# Altium schematic sheet Power.SchDoc
size A4
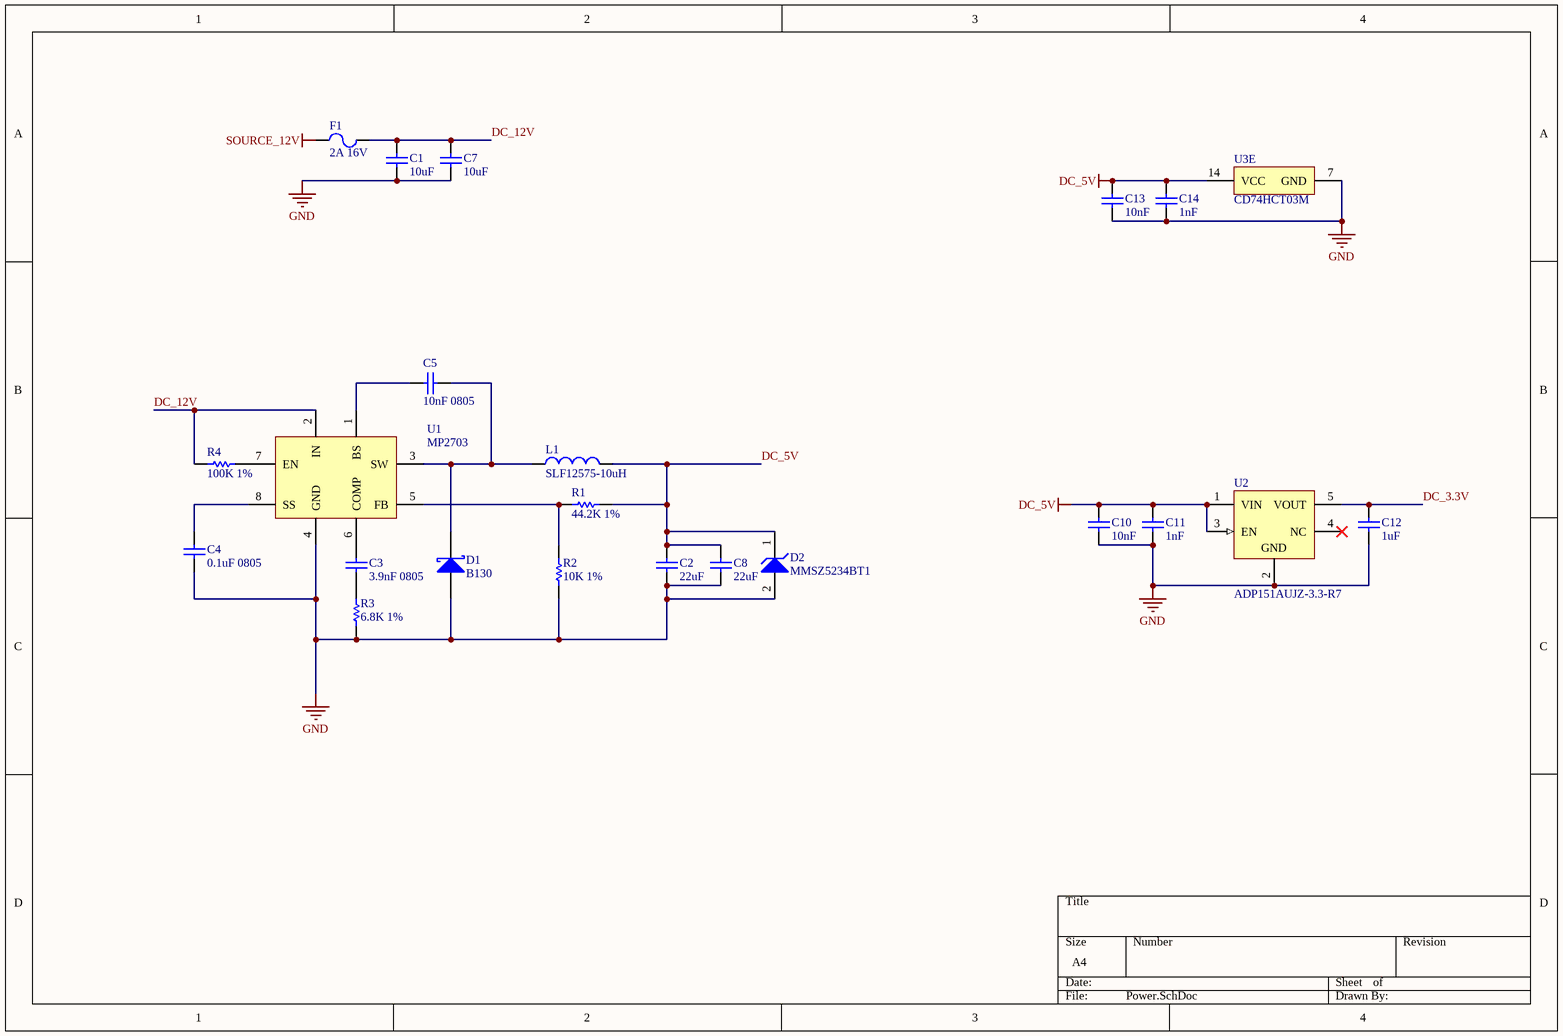
[diagram p0: Power.SchDoc]

## Parts
C1  10uF  [CAPC1206(3216)190_L]
C2  22uF  [CAPC1210(3225)250_M]
C3  3.9nF 0805  [CAPC0805(2012)145_N]
C4  0.1uF 0805  [CAPC0805(2012)145_N]
C5  10nF 0805  [CAPC0805(2012)145_N]
C7  10uF  [CAPC1206(3216)190_L]
C8  22uF  [CAPC1210(3225)250_M]
C10  10nF  [CAPC0805(2012)100_N]
C11  1nF  [CAPC0805(2012)100_N]
C12  1uF  [CAPC0805(2012)100_L]
C13  10nF  [CAPC0805(2012)100_N]
C14  1nF  [CAPC0805(2012)100_N]
D1  B130  [DIOD-SOD-123-2-A_V]
D2  MMSZ5234BT1  [ONSC-SOD-123-2-425-04_V]
F1  2A 16V  [LFUS-1812L16012_V]
L1  SLF12575-10uH  [TDK-SLF12575-H_V]
R1  44.2K 1%  [RESC0805(2012)_L]
R2  10K 1%  [RESC0805(2012)_L]
R3  6.8K 1%  [RESC0805(2012)_L]
R4  100K 1%  [RESC0805(2012)_L]
U1  MP2703  [LC-SOP-8_EP_150mil]
U2  ADP151AUJZ-3.3-R7  [ADI-UJ-5_M]
U3  CD74HCT03M  [D0014A_L]  (part E of 5)

## Nets
DC_5V: C2.2 C8.2 C10.2 C11.2 C13.2 C14.2 D2.1(K) L1.2 R1.1 U2.1(VIN) U2.3(EN) U3.14(VCC)
GND: C1.1 C2.1 C4.1 C7.1 C8.1 C10.1 C11.1 C12.1 C13.1 C14.1 D1.1(A) D2.2(A) R2.1 R3.1 U1.4(GND) U2.2(GND) U3.7(GND)
SOURCE_12V: F1.1
DC_3.3V: C12.2 U2.5(VOUT)
DC_12V: C1.2 C7.2 F1.2 R4.1 U1.2(IN)
NetC3_1: C3.1 R3.2
NetC3_2: C3.2 U1.6(COMP)
NetC4_2: C4.2 U1.8(SS)
NetC5_1: C5.1 D1.2(K) L1.1 U1.3(SW)
NetC5_2: C5.2 U1.1(BS)
NetR1_2: R1.2 R2.2 U1.5(FB)
NetR4_2: R4.2 U1.7(EN)

Not connected (* = marked no-connect by the designer): U2 4(NC)*

## Library data of the parts
C1 C7 = CMP-1037-04979-1: CAP 10uF 25V ±10% 1206 (3216 Metric) Thickness 1.9mm SMD; Case-EIA: 1206; Tolerance: Â±10%; Case-Metric: 3216; Rated Voltage: 25 V; Technology: SMT; Max Thickness: 1.9 mm; Value: 10uF
C2 C8 = CMP-1038-02267-1: CAP 22uF 10V ±10% 1210 (3225 Metric) Thickness 2.5mm SMD; Tolerance: Â±10%; Case-Metric: 3225; Case-EIA: 1210; Rated Voltage: 10 V; Max Thickness: 2.5 mm; Technology: SMT; Value: 22uF
C3-C5 = CMP-1036-04874-1: CAP 3.9uF 10V ±10% 0805 (2012 Metric) Thickness 1.45mm SMD; Case-Metric: 2012; Case-EIA: 0805; Tolerance: Â±10%; Value: 3.9uF; Max Thickness: 1.45 mm; Technology: SMT; Rated Voltage: 10 V
C10-C14 = CMP-1036-03820-1: CAP 10nF 16V ±10% 0805 (2012 Metric) Thickness 1mm SMD; Case-Metric: 2012; Tolerance: Â±10%; Case-EIA: 0805; Rated Voltage: 16 V; Value: 10nF; Technology: SMT; Max Thickness: 1 mm
D1 = CMP-2000-05884-1: Schottky Barrier Rectifier, 30 V, 1 A, -55 to 125 degC, 2-Pin SMD, RoHS, Tape and Reel; Manufacturer: DiodesIncorporated; Vrrm - Repetitive Reverse Voltage: 30V; Ir - Reverse Current: 1000uA; Vf - Forward Voltage: 0.42V; Ifsm - Forward Surge Current: 12A; If - Forward Current: 1A; Unit Weight: 0.000353oz; Configuration: Single; Factory Pack Quantity: 3000; Package Reference: SOD-123-2; Width: 1.7mm; Manufacturer URL: http://www.diodes.com/; Length: 2.85mm; Package / Case: SOD-123; Minimum Operating Temperature: -55C; Datasheet URL: http://www.diodes.com/_files/datasheets/ds30308.pdf; Package Description: 2-Pin Small Outline Diode, Body 2.7 x 1.55 mm; Operating Temperature Range: -55Cto+125C; Brand: DiodesIncorporated; Maximum Operating Temperature: +125C; Mounting Technology: SurfaceMount; Mounting Style: SMD/SMT; Series: B130; Packaging: Reel; Height: 1.25mm; Termination Style: SMD/SMT; Product Category: SchottkyDiodes&Rectifiers; Datasheet Version: Rev. 9-2, 06/2008; Type: SchottkyBarrierRectifier; RoHS: True; Product: SchottkyDiodes; Technology: Si
D2 = CMP-1060-00360-1: Zener Voltage Regulator, 500 mW, 2-Pin SOD-123, Tape and Reel; Manufacturer: On Semiconductor; VZ Typ (V): 6.2; P Max (W): 0.5; ComponentLink3URL: http://www.onsemi.com/pub_link/Collateral/425-04.PDF; PartNumber: MMSZ5234BT1; ComponentLink1Description: Manufacturer URL; PackageDescription: 2-Pin SOD, Body 1.6 x 2.69 mm; PackageReference: SOD-123-2-425-04; ComponentLink1URL: http://www.onsemi.com/; DatasheetVersion: Rev. 12; ComponentLink3Description: Package Specification; Mounting Technology: Surface Mount; Packing: Tape and Reel; PackageVersion: Rev. G, 10/2009; ComponentLink2Description: Datasheet; ComponentLink2URL: http://www.onsemi.com/pub_link/Collateral/MMSZ5221BT1-D.PDF
F1 = CMP-1700-00005-1: POLY-FUSE(R) Resettable PTC, 1.6 A, -40 to 85 degC, 1812 (4532 Metric), RoHS, Tape and Reel; Voltage Rating (DC): 300 V; Tolerance: 10%; Power Rating: 500 mW; Resistance: 10 kohm; PackageDescription: 2-Pin Surface Mount Device, Body 4.55 x 3.24 mm; Radiation Hardening: No; Width: 9.53 mm; Height: 0.25 inch; REACH SVHC: No SVHC; DatasheetVersion: Feb-16; Package Quantity: 50; ComponentLink1Description: Manufacturer URL; Min Operating Temperature: -55 degC; RoHSCompliant: true; Length: 9.53 mm; Max Operating Temperature: 150 degC; Packaging: Rail/Tube; Weight: 0.03 oz; ComponentLink1URL: http://www.littelfuse.com/; Voltage Rating: 300 V; ComponentLink2URL: http://www.littelfuse.com/~/media/electronics/datasheets/resettable_ptcs/littelfuse_ptc_1812l_datasheet.pdf.pdf; ComponentLink2Description: Datasheet; PackageReference: 1812; Mount: Through Hole
L1 = CMP-1663-00003-4: Power Inductor, 33 uH, +/-20%, -40 to 125 degC,2-Pin SMD, RoHS, Tape and Reel; Manufacturer: TDK; Current Rating: 3.2 A; REACH SVHC: No SVHC; PackageReference: SLF12575-H; RoHSCompliant: True; ComponentLink1URL: http://www.tdk.com/; Packaging: Tape and Reel; ComponentLink2URL: http://media.digikey.com/pdf/Data Sheets/TDK PDFs/SLF12575 Series Type H.pdf; Height: 7.5 mm; Max Operating Temperature: 105 �C; ComponentLink1Description: Manufacturer URL; Mount: Surface Mount; PackageDescription: 2-Pin Surface Mount Device, Body 12.5 x 12.5 mm; Package Quantity: 500; Mounting Technology: Surface Mount; ComponentLink2Description: Datasheet; DatasheetVersion: 03/2015; Min Operating Temperature: -40 �C; Length: 12.5 mm
R1-R4 = CMP-1013-00736-1: Value: 100000.00 Ohm; Case-Metric: 2012; Power: 0.125 W; Case-EIA: 0805; Tolerance: 1 %; Technology: SMT
U1 = MP2307: MP2307 – 3A, 23V, 340KHz SYNCHRONOUS RECTIFIED STEP-DOWN CONVERTER
U2 = CMP-0786-00387-1: Ultralow Noise, 200 mA, CMOS Linear Regulator, 2.2 to 5.5 V Vin, 3.3 V Vout, Industrial, 5-pin SOT23 (UJ-5), Reel; Manufacturer: Analog Devices; Vin (max) (V): 5.5; Supply Current IGND @ Small Load: 10uA; Vin (min) (V): 2.2; Preset Vout Values (V): 3.3; Iout max: 200mA; Packing: Reel; ComponentLink3URL: http:/www.analog.com/static/imported-files/packages/PKG_PDF/TSOT(UJ)/UJ_5.pdf; Mounting Technology: Surface Mount; DatasheetVersion: Rev. E; PartNumber: ADP151AUJZ-3.3-R7; ComponentLink4URL: Product URL:http://www.analog.com/en/ADP151/productSearch.html; ComponentLink1URL: http://www.analog.com/en/index.html; PackageReference: UJ-5; ComponentLink4Description: URL Link1; ComponentLink2URL: http://www.analog.com/static/imported-files/data_sheets/ADP151.pdf; ComponentLink2Description: Datasheet; ComponentLink1Description: Manufacturer URL; PackageVersion: 100708-A, 10/2008; PackageDescription: 5-Pin Thin Small Outline Transistor Package, Body 2.9 x 1.6 mm, Pitch 0.95 mm; ComponentLink3Description: Package Specification; Code_JEDEC: MO-193-AB
U3 = CMP-1627-00022-2: High Speed CMOS Logic Quad 2-Input NAND Gates with Open Drain, D0014A, TUBE; Manufacturer: Texas Instruments; Bits(#): 4; F @ Nom Voltage(Max)(Mhz): 25; Schmitt Trigger: No; Input Type: TTL; ICC @ Nom Voltage(Max)(mA): 0.02; Technology Family: HCT; VCC(Max)(V): 5.5; VCC(Min)(V): 4.5; tpd @ Nom Voltage(Max)(ns): 30; Output Drive (IOL/IOH)(Max)(mA): 0/4; Rating: Catalog; Voltage(Nom)(V): 5; Code_JEDEC: MS-012; Output Type: CMOS; Generic Part Number: CD74HCT03; PackageReference: D0014A; Operating Temperature Range(C): -55 to 125; DatasheetVersion: SCHS126D; PartId: 1